# EAGLE schematic devtool (EAGLE 8.3.2)
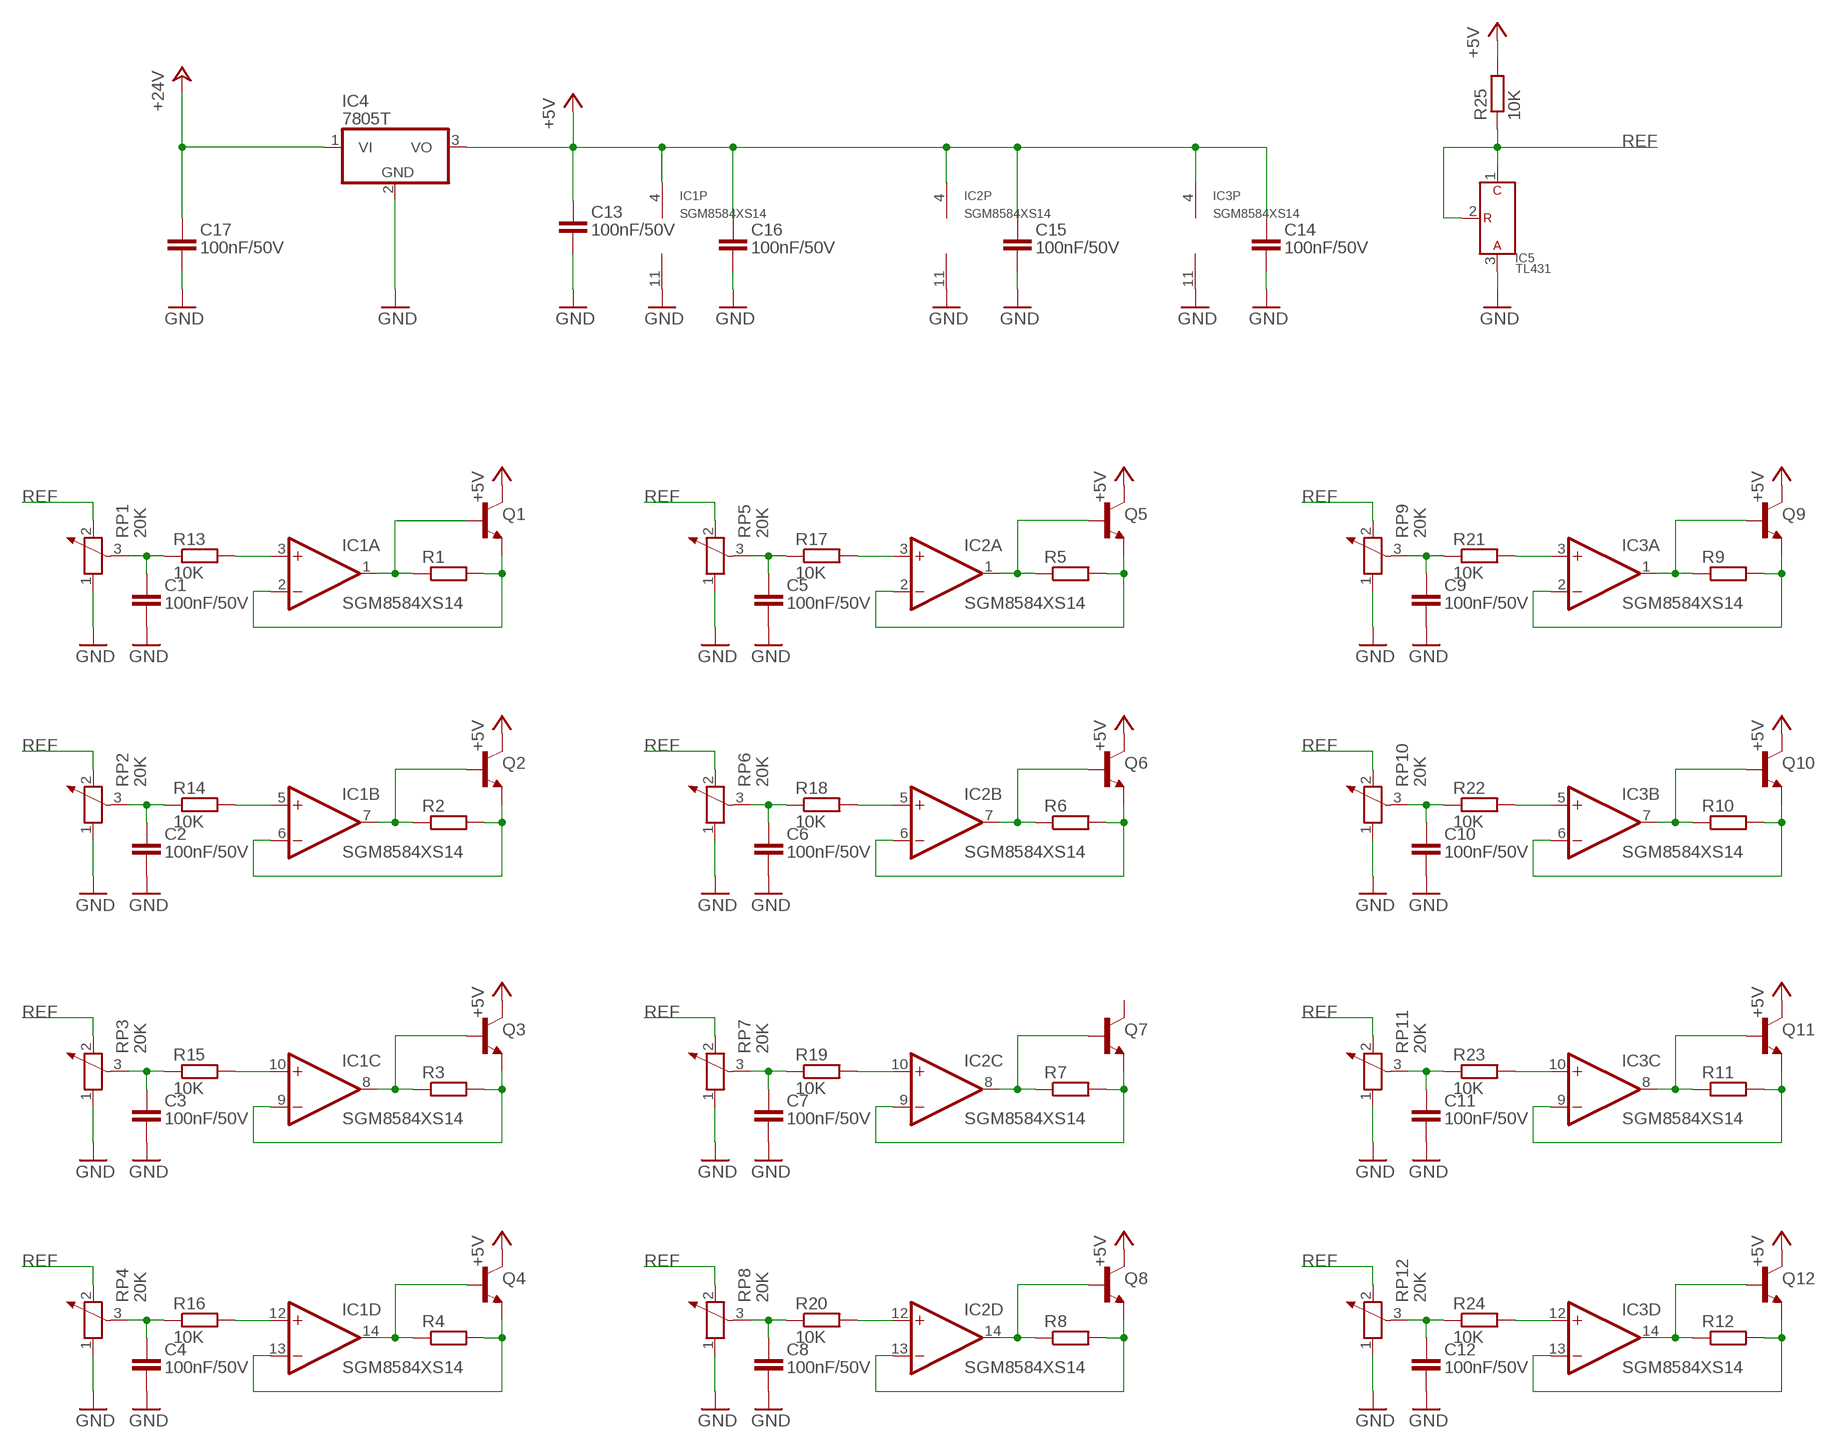
[diagram p0: schematic, sheet 1, part 1 of 2]
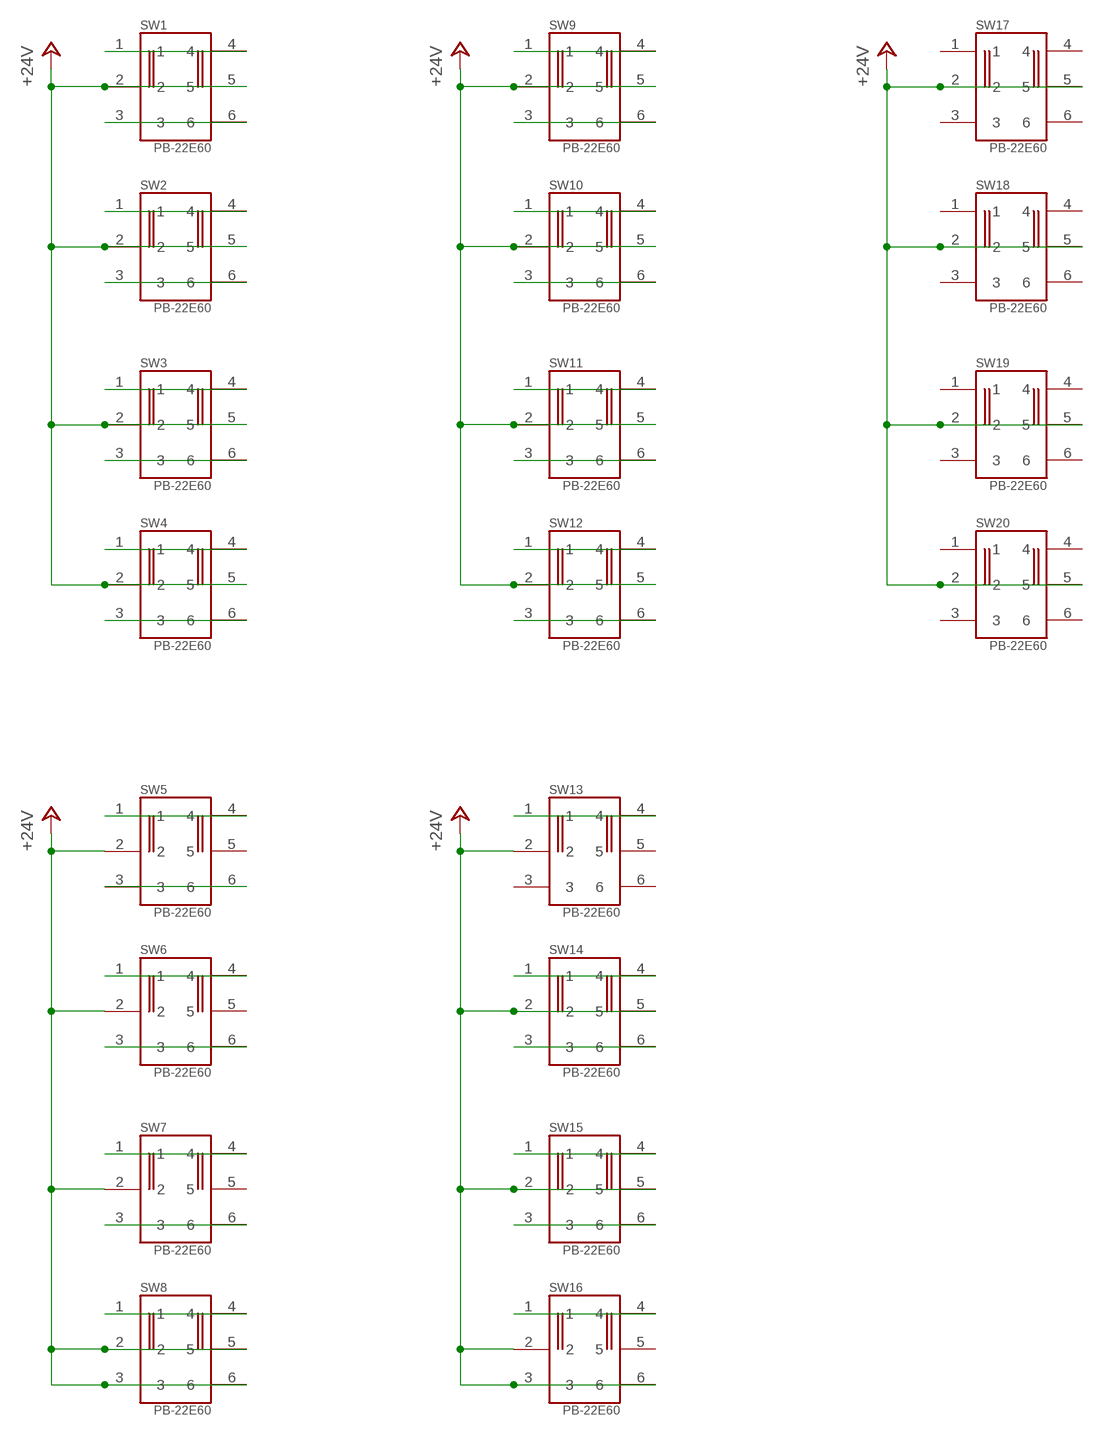
[diagram p1: schematic, sheet 1, part 2 of 2]

## Parts
C1  100nF/50V  C0603  [C0603]
C2  100nF/50V  C0603  [C0603]
C3  100nF/50V  C0603  [C0603]
C4  100nF/50V  C0603  [C0603]
C5  100nF/50V  C0603  [C0603]
C6  100nF/50V  C0603  [C0603]
C7  100nF/50V  C0603  [C0603]
C8  100nF/50V  C0603  [C0603]
C9  100nF/50V  C0603  [C0603]
C10  100nF/50V  C0603  [C0603]
C11  100nF/50V  C0603  [C0603]
C12  100nF/50V  C0603  [C0603]
C13  100nF/50V  C0603  [C0603]
C14  100nF/50V  C0603  [C0603]
C15  100nF/50V  C0603  [C0603]
C16  100nF/50V  C0603  [C0603]
C17  100nF/50V  C0603  [C0603]
IC1  SGM8584XS14  [SOIC-14]
IC2  SGM8584XS14  [SOIC-14]
IC3  SGM8584XS14  [SOIC-14]
IC4  7805T  [TO220H]
IC5  TL431  [SOT23-3]
Q1  NPN  [SOT23-BEC]
Q2  NPN  [SOT23-BEC]
Q3  NPN  [SOT23-BEC]
Q4  NPN  [SOT23-BEC]
Q5  NPN  [SOT23-BEC]
Q6  NPN  [SOT23-BEC]
Q7  NPN  [SOT23-BEC]
Q8  NPN  [SOT23-BEC]
Q9  NPN  [SOT23-BEC]
Q10  NPN  [SOT23-BEC]
Q11  NPN  [SOT23-BEC]
Q12  NPN  [SOT23-BEC]
R1  R0603  [R0603]
R2  R0603  [R0603]
R3  R0603  [R0603]
R4  R0603  [R0603]
R5  R0603  [R0603]
R6  R0603  [R0603]
R7  R0603  [R0603]
R8  R0603  [R0603]
R9  R0603  [R0603]
R10  R0603  [R0603]
R11  R0603  [R0603]
R12  R0603  [R0603]
R13  10K  R0603  [R0603]
R14  10K  R0603  [R0603]
R15  10K  R0603  [R0603]
R16  10K  R0603  [R0603]
R17  10K  R0603  [R0603]
R18  10K  R0603  [R0603]
R19  10K  R0603  [R0603]
R20  10K  R0603  [R0603]
R21  10K  R0603  [R0603]
R22  10K  R0603  [R0603]
R23  10K  R0603  [R0603]
R24  10K  R0603  [R0603]
R25  10K  R0603  [R0603]
RP1  20K  RM065  [RM065]
RP2  20K  RM065  [RM065]
RP3  20K  RM065  [RM065]
RP4  20K  RM065  [RM065]
RP5  20K  RM065  [RM065]
RP6  20K  RM065  [RM065]
RP7  20K  RM065  [RM065]
RP8  20K  RM065  [RM065]
RP9  20K  RM065  [RM065]
RP10  20K  RM065  [RM065]
RP11  20K  RM065  [RM065]
RP12  20K  RM065  [RM065]
SW1  PB-22E60  [PB-22E60]
SW2  PB-22E60  [PB-22E60]
SW3  PB-22E60  [PB-22E60]
SW4  PB-22E60  [PB-22E60]
SW5  PB-22E60  [PB-22E60]
SW6  PB-22E60  [PB-22E60]
SW7  PB-22E60  [PB-22E60]
SW8  PB-22E60  [PB-22E60]
SW9  PB-22E60  [PB-22E60]
SW10  PB-22E60  [PB-22E60]
SW11  PB-22E60  [PB-22E60]
SW12  PB-22E60  [PB-22E60]
SW13  PB-22E60  [PB-22E60]
SW14  PB-22E60  [PB-22E60]
SW15  PB-22E60  [PB-22E60]
SW16  PB-22E60  [PB-22E60]
SW17  PB-22E60  [PB-22E60]
SW18  PB-22E60  [PB-22E60]
SW19  PB-22E60  [PB-22E60]
SW20  PB-22E60  [PB-22E60]

## Nets
+5V: C13.1 C14.1 C15.1 C16.1 IC1.4(P:V+) IC2.4(P:V+) IC3.4(P:V+) IC4.3(VO) Q1.C Q2.C Q3.C Q4.C Q5.C Q6.C Q8.C Q9.C Q10.C Q11.C Q12.C R25.2
+24V: C17.1 IC4.1(VI) SW1.2 SW1.5 SW2.2 SW2.5 SW3.2 SW3.5 SW4.2 SW4.5 SW5.2 SW6.2 SW7.2 SW8.2 SW8.3 SW8.5 SW8.6 SW9.2 SW9.5 SW10.2 SW10.5 SW11.2 SW11.5 SW12.2 SW12.5 SW13.2 SW14.2 SW14.5 SW15.2 SW15.5 SW16.2 SW16.3 SW16.6 SW17.2 SW17.5 SW18.2 SW18.5 SW19.2 SW19.5 SW20.2 SW20.5
GND: C1.2 C2.2 C3.2 C4.2 C5.2 C6.2 C7.2 C8.2 C9.2 C10.2 C11.2 C12.2 C13.2 C14.2 C15.2 C16.2 C17.2 IC1.11(P:V-) IC2.11(P:V-) IC3.11(P:V-) IC4.2(GND) IC5.3(A) RP1.1 RP2.1 RP3.1 RP4.1 RP5.1 RP6.1 RP7.1 RP8.1 RP9.1 RP10.1 RP11.1 RP12.1
N$1: SW12.3 SW12.6
N$2: IC1.1(A:OUT) Q1.B R1.1
N$3: IC1.7(B:OUT) Q2.B R2.1
N$4: IC1.8(C:OUT) Q3.B R3.1
N$5: IC1.14(D:OUT) Q4.B R4.1
N$6: IC2.1(A:OUT) Q5.B R5.1
N$7: IC2.7(B:OUT) Q6.B R6.1
N$8: IC2.8(C:OUT) Q7.B R7.1
N$9: IC2.14(D:OUT) Q8.B R8.1
N$10: IC3.1(A:OUT) Q9.B R9.1
N$11: IC3.7(B:OUT) Q10.B R10.1
N$12: IC3.8(C:OUT) Q11.B R11.1
N$13: IC3.14(D:OUT) Q12.B R12.1
N$14: IC1.2(A:-IN) Q1.E R1.2
N$15: IC3.13(D:-IN) Q12.E R12.2
N$16: IC3.9(C:-IN) Q11.E R11.2
N$17: IC3.6(B:-IN) Q10.E R10.2
N$18: IC3.2(A:-IN) Q9.E R9.2
N$19: IC1.6(B:-IN) Q2.E R2.2
N$20: IC1.9(C:-IN) Q3.E R3.2
N$21: IC1.13(D:-IN) Q4.E R4.2
N$22: IC2.2(A:-IN) Q5.E R5.2
N$23: IC2.6(B:-IN) Q6.E R6.2
N$24: IC2.9(C:-IN) Q7.E R7.2
N$25: IC2.13(D:-IN) Q8.E R8.2
N$26: SW14.3 SW14.6
N$27: SW14.1 SW14.4
N$28: SW13.1 SW13.4
N$29: SW15.1 SW15.4
N$30: SW15.3 SW15.6
N$31: SW16.1 SW16.4
N$32: SW8.1 SW8.4
N$33: SW7.3 SW7.6
N$34: SW7.1 SW7.4
N$35: SW6.3 SW6.6
N$36: SW6.1 SW6.4
N$37: SW5.3 SW5.6
N$38: SW5.1 SW5.4
N$39: SW4.3 SW4.6
N$40: SW4.1 SW4.4
N$41: SW3.1 SW3.4
N$42: SW3.3 SW3.6
N$43: SW2.1 SW2.4
N$44: SW2.3 SW2.6
N$45: SW1.3 SW1.6
N$46: SW1.1 SW1.4
N$47: SW9.1 SW9.4
N$48: SW9.3 SW9.6
N$49: SW10.1 SW10.4
N$50: SW10.3 SW10.6
N$51: SW11.1 SW11.4
N$52: SW11.3 SW11.6
N$53: SW12.1 SW12.4
N$54: C1.1 R13.1 RP1.3
N$55: C2.1 R14.1 RP2.3
N$56: C3.1 R15.1 RP3.3
N$57: C4.1 R16.1 RP4.3
N$58: C5.1 R17.1 RP5.3
N$59: C6.1 R18.1 RP6.3
N$60: C7.1 R19.1 RP7.3
N$61: C8.1 R20.1 RP8.3
N$62: C9.1 R21.1 RP9.3
N$63: C10.1 R22.1 RP10.3
N$64: C11.1 R23.1 RP11.3
N$65: C12.1 R24.1 RP12.3
N$66: IC1.3(A:+IN) R13.2
N$67: IC1.5(B:+IN) R14.2
N$68: IC1.10(C:+IN) R15.2
N$69: IC1.12(D:+IN) R16.2
N$70: IC2.12(D:+IN) R20.2
N$71: IC2.10(C:+IN) R19.2
N$72: IC2.5(B:+IN) R18.2
N$73: IC2.3(A:+IN) R17.2
N$74: IC3.3(A:+IN) R21.2
N$75: IC3.5(B:+IN) R22.2
N$76: IC3.10(C:+IN) R23.2
N$77: IC3.12(D:+IN) R24.2
REF: IC5.1(C) IC5.2(REF) R25.1 RP1.2 RP2.2 RP3.2 RP4.2 RP5.2 RP6.2 RP7.2 RP8.2 RP9.2 RP10.2 RP11.2 RP12.2
Unconnected: Q7.C SW5.5 SW6.5 SW7.5 SW13.3 SW13.5 SW13.6 SW16.5 SW17.1 SW17.3 SW17.4 SW17.6 SW18.1 SW18.3 SW18.4 SW18.6 SW19.1 SW19.3 SW19.4 SW19.6 SW20.1 SW20.3 SW20.4 SW20.6

## Library data of the parts
C1-C17 = SHMT:C
IC1-IC3 = prj_snowmaker:SGM8584: OP AMP
IC4 = linear:78*: Positive VOLTAGE REGULATOR Source: http://cache.national.com/ds/LM/LM78L05.pdf http://www.fairchildsemi.com/ds/LM/LM7805.pdf
IC5 = SHMT:TL431
Q1-Q12 = SHMT:NPN
R1-R25 = SHMT:R
RP1-RP12 = SHMT:RM065
SW1-SW20 = SHMT:PB-22E60